# EAGLE schematic Front ECU rev7 (EAGLE 8.3.1)
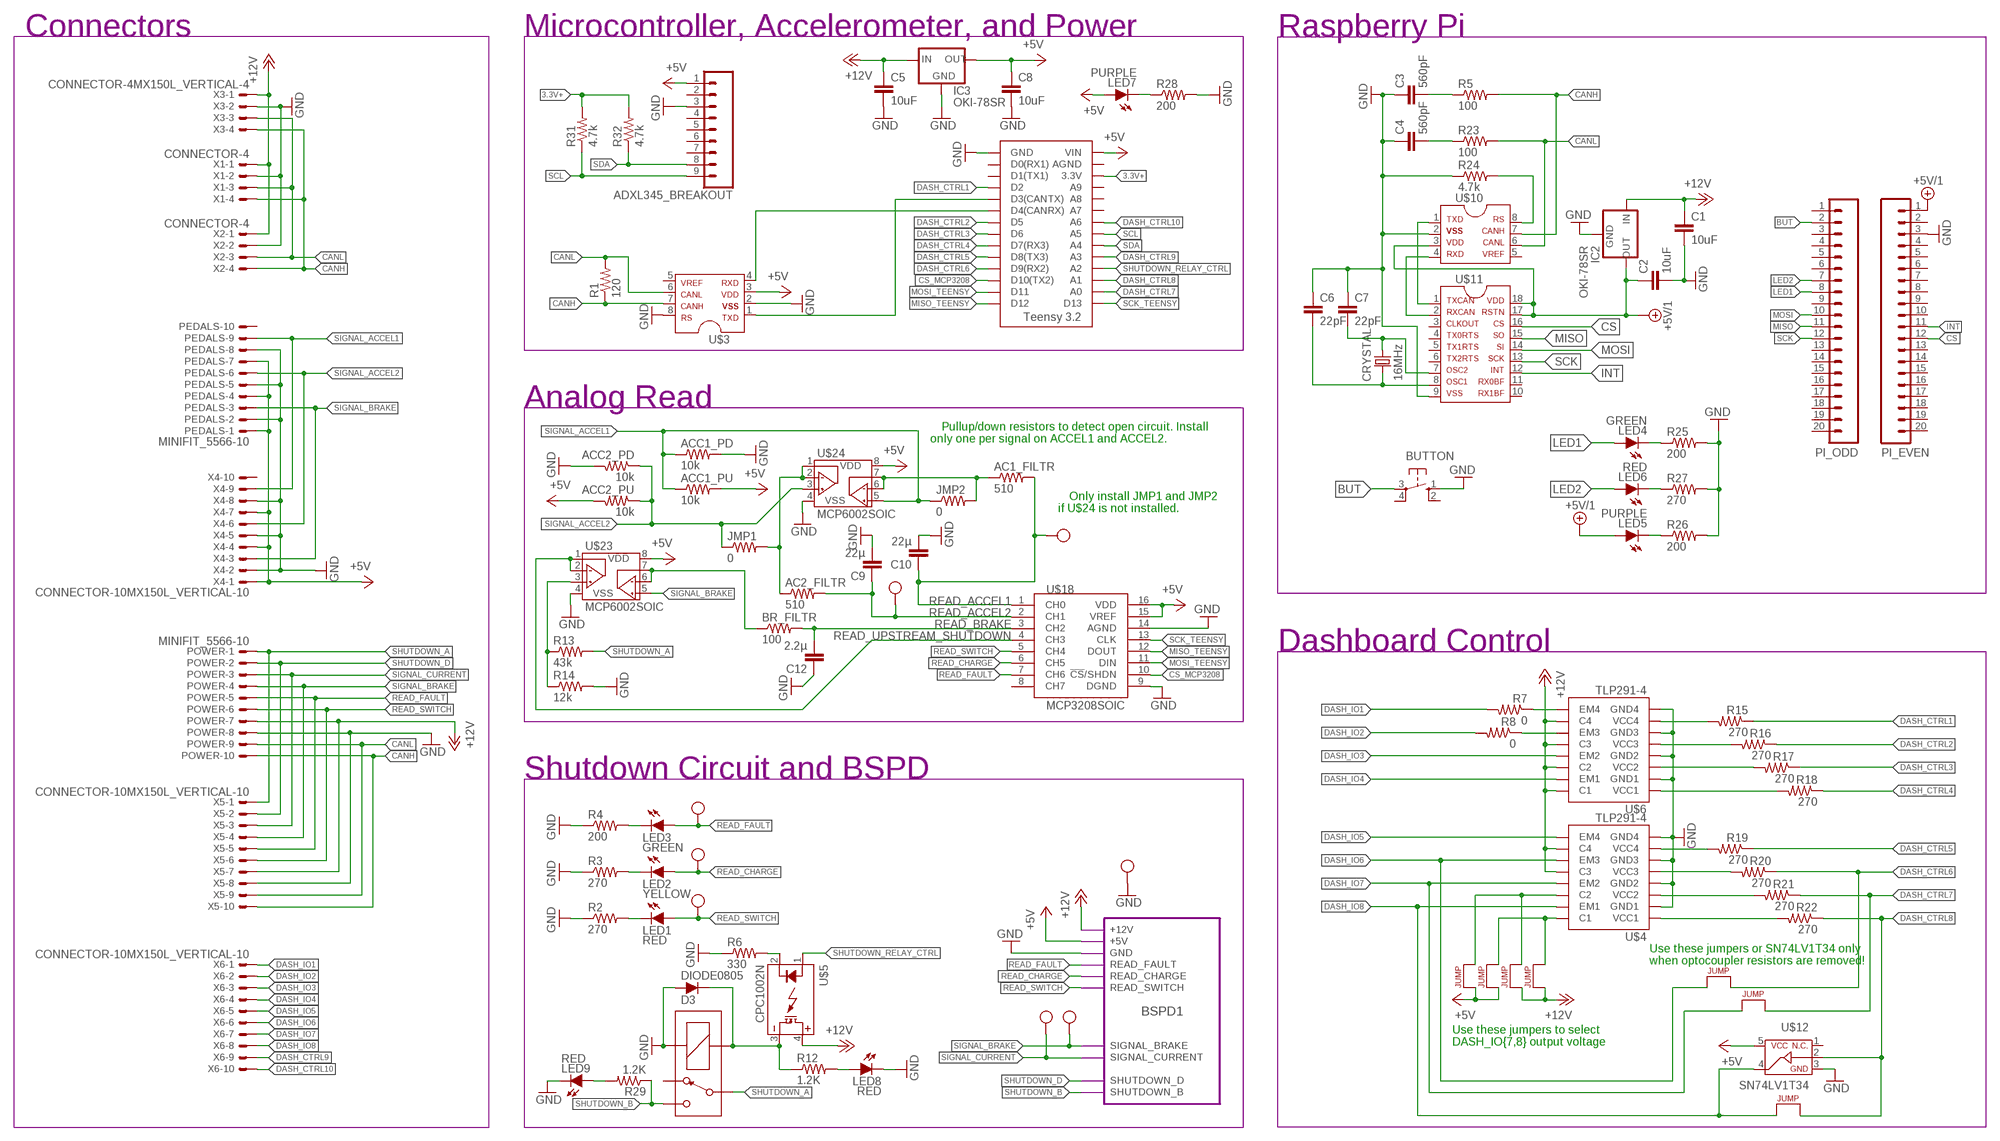
[diagram p0: schematic, sheet 1]

## Parts
AC1_FILTR  510  RESISTOR0805-RES  [0805]
AC2_FILTR  510  RESISTOR0805-RES  [0805]
ACC1_PD  10k  RESISTOR0805-RES  [0805]
ACC1_PU  10k  RESISTOR0805-RES  [0805]
ACC2_PD  10k  RESISTOR0805-RES  [0805]
ACC2_PU  10k  RESISTOR0805-RES  [0805]
ADXL345_BREAKOUT  M09  [1X09]
BR_FILTR  100  RESISTOR0805-RES  [0805]
BUTTON  BTN_10-XX  [B3F-10XX]
C1  10uF  CAP0805  [0805]
C2  10uF  CAP0805  [0805]
C3  560pF  CAP0805  [0805]
C4  560pF  CAP0805  [0805]
C5  10uF  CAP0805  [0805]
C6  22pF  CAP0805  [0805]
C7  22pF  CAP0805  [0805]
C8  10uF  CAP0805  [0805]
C9  22µ  CAP0805  [0805]
C10  22µ  CAP0805  [0805]
C12  2.2µ  CAP0805  [0805]
CRYSTAL  16MHz  CRYSTALSMD  [HC49UP]
D3  DIODE0805  [0805_D]
IC2  OKI-78SR  [OKI-78SR]
IC3  OKI-78SR  [OKI-78SR]
JMP1  0  RESISTOR0805-RES  [0805]
JMP2  0  RESISTOR0805-RES  [0805]
LED1  RED  LED-0805  [LED-805]
LED2  YELLOW  LED-0805  [LED-805]
LED3  GREEN  LED-0805  [LED-805]
LED4  GREEN  LED-0805  [LED-805]
LED5  PURPLE  LED-0805  [LED-805]
LED6  RED  LED-0805  [LED-805]
LED7  PURPLE  LED-0805  [LED-805]
LED8  RED  LED-0805  [LED-805]
LED9  RED  LED-0805  [LED-805]
PEDALS  MINIFIT_5566-10  [MINIFIT_5566-10]
PI_EVEN  M20  [1X20]
PI_ODD  M20  [1X20]
POWER  MINIFIT_5566-10  [MINIFIT_5566-10]
R1  120  RESISTOR0805-RES  [0805]
R2  270  RESISTOR0805-RES  [0805]
R3  270  RESISTOR0805-RES  [0805]
R4  200  RESISTOR0805-RES  [0805]
R5  100  RESISTOR0805-RES  [0805]
R6  330  RESISTOR0805-RES  [0805]
R7  0  RESISTOR0805-RES  [0805]
R8  0  RESISTOR0805-RES  [0805]
R12  1.2K  RESISTOR0805-RES  [0805]
R13  43k  RESISTOR0805-RES  [0805]
R14  12k  RESISTOR0805-RES  [0805]
R15  270  RESISTOR0805-RES  [0805]
R16  270  RESISTOR0805-RES  [0805]
R17  270  RESISTOR0805-RES  [0805]
R18  270  RESISTOR0805-RES  [0805]
R19  270  RESISTOR0805-RES  [0805]
R20  270  RESISTOR0805-RES  [0805]
R21  270  RESISTOR0805-RES  [0805]
R22  270  RESISTOR0805-RES  [0805]
R23  100  RESISTOR0805-RES  [0805]
R24  4.7k  RESISTOR0805-RES  [0805]
R25  200  RESISTOR0805-RES  [0805]
R26  200  RESISTOR0805-RES  [0805]
R27  270  RESISTOR0805-RES  [0805]
R28  200  RESISTOR0805-RES  [0805]
R29  1.2K  RESISTOR0805-RES  [0805]
R31  4.7k  RESISTOR0805-RES  [0805]
R32  4.7k  RESISTOR0805-RES  [0805]
SOFTWARE_SHUTOFF  G5LE  [ZF112]
U$1  TEENSY_3.2_SIMPLE  [TEENSY_3.2_SIMPLE]
U$2  TEST_POINT  [TEST_POINT]
U$3  MCP2551  [SOIC-08]
U$4  TLP291-4  [SOIC-16]
U$5  CPC1002N  [SOP04]
U$6  TLP291-4  [SOIC-16]
U$7  JUMPER  [0805]
U$8  JUMPER  [0805]
U$9  JUMPER  [0805]
U$10  MCP2551  [SOIC-08]
U$11  MCP2515SMD  [SOIC-18W]
U$12  SN74LV1T34  [SOT-23-5]
U$13  TEST_POINT  [TEST_POINT]
U$14  TEST_POINT  [TEST_POINT]
U$15  TEST_POINT  [TEST_POINT]
U$16  TEST_POINT  [TEST_POINT]
U$17  TEST_POINT  [TEST_POINT]
U$18  MCP3208SOIC  [SOIC-16]
U$19  JUMPER  [0805]
U$20  JUMPER  [0805]
U$21  JUMPER  [0805]
U$22  JUMPER  [0805]
U$23  MCP6002SOIC  [SOIC-08]
U$24  MCP6002SOIC  [SOIC-08]
U$25  TEST_POINT  [TEST_POINT]
U$26  TEST_POINT  [TEST_POINT]
X1  CONNECTOR-4  [MINIFIT_5566-4]
X2  CONNECTOR-4  [MINIFIT_5566-4]
X3  CONNECTOR-4MX150L_VERTICAL-4  [MX150L_VERTICAL-4]
X4  CONNECTOR-10MX150L_VERTICAL-10  [MX150L_VERTICAL-10]
X5  CONNECTOR-10MX150L_VERTICAL-10  [MX150L_VERTICAL-10]
X6  CONNECTOR-10MX150L_VERTICAL-10  [MX150L_VERTICAL-10]

## Module instances
BSPD1 = BSPD

## Nets
3.3V+: R31.2 R32.2 U$1.3.3V
+5V: ACC1_PU.2 ACC2_PU.2 ADXL345_BREAKOUT.1 C8.1 IC3.3(OUT) LED7.A PEDALS.1 PEDALS.4 PEDALS.7 U$1.VIN U$3.3 U$12.5 U$18.15(VREF) U$18.16(VDD) U$20.1 U$22.1 U$23.8(VDD) U$24.8(VDD) X4.1 X4.4 X4.7 ; port BSPD1.+5V
+5V/1: C2.1 IC2.3(OUT) LED5.A PI_EVEN.1 U$10.3 U$11.17 U$11.18
+12V: C1.1 C5.1 IC2.1(IN) IC3.1(IN) POWER.7 U$4.10(C4) U$4.12(C3) U$5.4(DC+) U$6.10(C4) U$6.12(C3) U$6.14(C2) U$6.16(C1) U$9.1 U$21.1 X1.1 X2.1 X3.1 X5.7 ; port BSPD1.+12V
BUT: BUTTON.3(P) PI_ODD.2
CANH: POWER.10 R1.1 R5.2 U$3.7 U$10.7 X1.4 X2.4 X3.4 X5.10
CANL: POWER.9 R1.2 R23.2 U$3.6 U$10.6 X1.3 X2.3 X3.3 X5.9
CS: PI_EVEN.12 U$11.16
CS_MCP3208: U$1.D10(TX2) U$18.10(!CS!/SHDN)
DASH_CTRL1: R15.1 U$1.D2
DASH_CTRL2: R16.1 U$1.D5
DASH_CTRL3: R17.1 U$1.D6
DASH_CTRL4: R18.1 U$1.D7(RX3)
DASH_CTRL5: R19.1 U$1.D8(TX3)
DASH_CTRL6: R20.1 U$1.D9(RX2) U$7.2
DASH_CTRL7: R21.1 U$1.A0 U$8.2
DASH_CTRL8: R22.1 U$1.A1 U$12.2 U$19.2
DASH_CTRL9: U$1.A3 X6.9
DASH_CTRL10: U$1.A6 X6.10
DASH_IO1: R7.2 X6.1
DASH_IO2: R8.2 X6.2
DASH_IO3: U$6.13(EM2) X6.3
DASH_IO4: U$6.15(EM1) X6.4
DASH_IO5: U$4.9(EM4) X6.5
DASH_IO6: U$4.11(EM3) U$7.1 X6.6
DASH_IO7: U$4.13(EM2) U$8.1 X6.7
DASH_IO8: U$4.15(EM1) U$12.4 U$19.1 X6.8
GND: ACC1_PD.2 ACC2_PD.2 ADXL345_BREAKOUT.3 BUTTON.1(S) C1.2 C2.2 C3.1 C4.1 C5.2 C6.1 C7.1 C8.2 C9.2 C10.2 C12.1 D3.A IC2.2(GND) IC3.2(GND) LED8.C LED9.C PEDALS.2 PEDALS.5 PEDALS.8 PI_EVEN.3 POWER.8 R2.1 R3.1 R4.1 R6.1 R14.2 R24.1 R25.2 R26.2 R27.2 R28.2 SOFTWARE_SHUTOFF.1(COIL+) U$1.GND U$2.P$1 U$3.2 U$3.8 U$4.2(GND1) U$4.4(GND2) U$4.6(GND3) U$4.8(GND4) U$6.2(GND1) U$6.4(GND2) U$6.6(GND3) U$6.8(GND4) U$10.2 U$11.9 U$12.3 U$18.9(DGND) U$18.14(AGND) U$23.4(VSS) U$24.4(VSS) X1.2 X2.2 X3.2 X4.2 X4.5 X4.8 X5.8 ; port BSPD1.GND
INT: PI_EVEN.11 U$11.12
LED1: LED4.A PI_ODD.8
LED2: LED6.A PI_ODD.7
MISO: PI_ODD.11 U$11.15
MISO_TEENSY: U$1.D12 U$18.12(DOUT)
MOSI: PI_ODD.10 U$11.14
MOSI_TEENSY: U$1.D11 U$18.11(DIN)
N$1: R7.1 U$6.9(EM4)
N$2: U$1.D4(CANRX) U$3.4
N$3: R8.1 U$6.11(EM3)
N$4: U$4.16(C1) U$9.2 U$20.2
N$5: U$1.D3(CANTX) U$3.1
N$6: U$4.14(C2) U$21.2 U$22.2
N$7: R13.1 R14.1 U$23.3(VINA+)
N$8: LED8.A R12.2
N$9: LED9.A R29.2
N$11: BR_FILTR.1 U$23.6(VINB-) U$23.7(VOUTB)
N$12: D3.C R12.1 SOFTWARE_SHUTOFF.2(COIL-) U$5.3(DC-)
N$13: AC2_FILTR.1 JMP1.2 U$24.1(VOUTA) U$24.2(VINA-)
N$14: LED1.C R2.2
N$15: LED2.C R3.2
N$16: LED3.C R4.2
N$17: AC1_FILTR.1 JMP2.2 U$24.6(VINB-) U$24.7(VOUTB)
N$19: R15.2 U$6.7(VCC4)
N$22: R6.2 U$5.2(CONTROL-)
N$24: R16.2 U$6.5(VCC3)
N$27: R21.2 U$4.3(VCC2)
N$28: R17.2 U$6.3(VCC2)
N$29: R18.2 U$6.1(VCC1)
N$31: R19.2 U$4.7(VCC4)
N$32: R20.2 U$4.5(VCC3)
N$35: R22.2 U$4.1(VCC1)
N$37: U$10.1 U$11.1
N$39: U$10.4 U$11.2
N$40: C6.2 CRYSTAL.2 U$11.8
N$41: R24.2 U$10.8
N$42: C7.2 CRYSTAL.1 U$11.7
N$43: C3.2 R5.1
N$50: C4.2 R23.1
N$52: LED4.C R25.1
N$53: LED5.C R26.1
N$54: LED6.C R27.1
N$61: LED7.C R28.1
READ_ACCEL1: AC1_FILTR.2 C10.1 U$18.1(CH0) U$26.P$1
READ_ACCEL2: AC2_FILTR.2 C9.1 U$18.2(CH1) U$25.P$1
READ_BRAKE: BR_FILTR.2 C12.2 U$18.3(CH2)
READ_CHARGE: LED2.A U$16.P$1 U$18.6(CH5) ; port BSPD1.READ_CHARGE
READ_FAULT: LED3.A POWER.5 U$15.P$1 U$18.7(CH6) X5.5 ; port BSPD1.READ_FAULT
READ_SWITCH: LED1.A POWER.6 U$17.P$1 U$18.5(CH4) X5.6 ; port BSPD1.READ_SWITCH
READ_UPSTREAM_SHUTDOWN: U$18.4(CH3) U$23.1(VOUTA) U$23.2(VINA-)
SCK: PI_ODD.12 U$11.13
SCK_TEENSY: U$1.D13 U$18.13(CLK)
SCL: ADXL345_BREAKOUT.9 R31.1 U$1.A5
SDA: ADXL345_BREAKOUT.8 R32.1 U$1.A4
SHUTDOWN_A: POWER.1 R13.2 SOFTWARE_SHUTOFF.P X5.1
SHUTDOWN_B: R29.1 SOFTWARE_SHUTOFF.S ; port BSPD1.SHUTDOWN_B
SHUTDOWN_D: POWER.2 X5.2 ; port BSPD1.SHUTDOWN_D
SHUTDOWN_RELAY_CTRL: U$1.A2 U$5.1(CONTROL+)
SIGNAL_ACCEL1: ACC1_PD.1 ACC1_PU.1 JMP2.1 PEDALS.9 U$24.5(VINB+) X4.9
SIGNAL_ACCEL2: ACC2_PD.1 ACC2_PU.1 JMP1.1 PEDALS.6 U$24.3(VINA+) X4.6
SIGNAL_BRAKE: PEDALS.3 POWER.4 U$13.P$1 U$23.5(VINB+) X4.3 X5.4 ; port BSPD1.SIGNAL_BRAKE
SIGNAL_CURRENT: POWER.3 U$14.P$1 X5.3 ; port BSPD1.SIGNAL_CURRENT
Unconnected: ADXL345_BREAKOUT.2 ADXL345_BREAKOUT.4 ADXL345_BREAKOUT.5 ADXL345_BREAKOUT.6 ADXL345_BREAKOUT.7 BUTTON.2(S1) BUTTON.4(P1) PEDALS.10 PI_EVEN.2 PI_EVEN.4 PI_EVEN.5 PI_EVEN.6 PI_EVEN.7 PI_EVEN.8 PI_EVEN.9 PI_EVEN.10 PI_EVEN.13 PI_EVEN.14 PI_EVEN.15 PI_EVEN.16 PI_EVEN.17 PI_EVEN.18 PI_EVEN.19 PI_EVEN.20 PI_ODD.1 PI_ODD.3 PI_ODD.4 PI_ODD.5 PI_ODD.6 PI_ODD.9 PI_ODD.13 PI_ODD.14 PI_ODD.15 PI_ODD.16 PI_ODD.17 PI_ODD.18 PI_ODD.19 PI_ODD.20 SOFTWARE_SHUTOFF.O U$1.A7 U$1.A8 U$1.A9 U$1.AGND U$1.D0(RX1) U$1.D1(TX1) U$3.5 U$10.5 U$11.3 U$11.4 U$11.5 U$11.6 U$11.10 U$11.11 U$12.1 U$18.8(CH7) X4.10

## Notes on the sheet
- Connectors | Microcontroller, Accelerometer, and Power | Raspberry Pi
- Analog Read
- ⇦ Pullup/down resistors to detect open circuit. Install
  only one per signal on ACCEL1 and ACCEL2.
- ⇦ Only install JMP1 and JMP2
  if U$24 is not installed.
- Dashboard Control
- Shutdown Circuit and BSPD
- Use these jumpers or SN74LV1T34 only
  when optocoupler resistors are removed!
- Use these jumpers to select
  DASH_IO{7,8} output voltage

## Library data of the parts
AC1_FILTR AC2_FILTR ACC1_PD ACC1_PU ACC2_PD ACC2_PU BR_FILTR JMP1 JMP2 R1-R8 R12-R29 R31 R32 = HyTechDevices:RESISTOR: Resistor Basic schematic elements and footprints for 0603, 1206, and PTH resistors.
ADXL345_BREAKOUT = HyTechDevices:M09: Standard 9-pin 0.1" header. Source: Sparkfun <https://github.com/sparkfun/SparkFun-Eagle-Libraries>
BUTTON = HyTechDevices:BTN_10-XX: Small momentary tactile push button; MPN: B3F-1000; OC_FARNELL: 176432; OC_NEWARK: 36M3542
C1-C10 C12 = HyTechDevices:CAP: Capacitor Standard 0603 ceramic capacitor, and 0.1" leaded capacitor.
CRYSTAL = SparkFun-FreqCtrl:CRYSTAL: Various standard crystals. Proven footprints.
D3 = HyTechDevices:DIODE: DIODE general purpose rectifier
IC2 IC3 = HyTechDevices:OKI-78SR: Murata OKI-78SR Non-Isolated Switching Regulator DC/DC - Datasheet <https://power.murata.com/data/power/oki-78sr.pdf>
LED1-LED9 = HyTechDevices:LED: Light Emitting Diode (LED) Source: Dangerous Prototypes Eagle Library <https://github.com/DangerousPrototypes/Eagle_Part_Library>
PEDALS POWER = HyTechDevices:MINIFIT_5566-10: Mini-Fit Junior connector 10 pole Source: http://www.molex.com; OC_FARNELL: unknown; OC_NEWARK: unknown
PI_EVEN PI_ODD = HyTechDevices:M20: 1x20 .1" header This is just like the LOCK variant in that the holes are staggared by 5 mil, but except for the last two holes. They are not altered from the "standard" footprint layout. This is used for a special purpose on the layout of our Graphic LCD Backpack. Make sure you want to use this device before selecting it for you project! Source: Sparkfun <https://github.com/sparkfun/SparkFun-Eagle-Libraries>
SOFTWARE_SHUTOFF = HyTechDevices:G5LE: Omron G5LE SPST Relay 5 VDC, 12VDC, 24VDC models Coil voltage: 75% - 170% of nominal voltage Datasheet <https://www.omron.com/ecb/products/pdf/en-g5le.pdf>
U$1 = HyTechDevices:TEENSY_3.2_SIMPLE: Simple version of the Teensy 3.2 board that only uses the 2 main rows of pins, not the inner pins or the pins opposite the usb port.
U$2 U$13-U$17 U$25 U$26 = HyTechDevices:TEST_POINT: Keystone Electronics Test Point 5005
U$3 U$10 = HyTechDevices:MCP2551: MCP2551 High-Speed CAN Transceiver Product Webpage <https://www.microchip.com/wwwproducts/en/MCP2551> Datasheet <http://ww1.microchip.com/downloads/en/DeviceDoc/21667f.pdf> This device is outdated It is replaced by MCP2561. Comparison Page <https://www.microchip.com/wwwproducts/ProductCompare/MCP2551/MCP2561> Product Webpage <https://www.microchip.com/wwwproducts/en/MCP2561> Datasheet <http://ww1.microchip.com/downloads/en/DeviceDoc/20005167C.pdf>
U$4 U$6 = HyTechDevices:TLP291-4: Toshiba Quad Channel Optocoupler TLP291-4
U$5 = HyTechDevices:CPC1002N: IXYS Solid State Relay .7A
U$7-U$9 U$19-U$22 = HyTechDevices:JUMPER: Jumper for changing operation of a device
U$11 = HyTechDevices:MCP2515: MCP2515 CAN Controller with SPI Interface Datasheet <http://ww1.microchip.com/downloads/en/DeviceDoc/21801G.pdf>
U$12 = HyTechDevices:SN74LV1T34: TI SN74LV1T34 Single Power Supply Single Buffer GATE CMOS Logic Level Shifter Datasheet <http://www.ti.com/lit/ds/symlink/sn74lv1t34.pdf>
U$18 = HyTechDevices:MCP3208: Analog to Digital Converter
U$23 U$24 = HyTechDevices:MCP6002: Microchip MCP6002 Dual Channel Op Amp
X1 X2 = HyTechDevices:CONNECTOR-4: Mini-Fit Junior connector 4 pole Source: http://www.molex.com; OC_FARNELL: unknown; OC_NEWARK: unknown
X3 = HyTechDevices:CONNECTOR-4: Mini-Fit Junior connector 4 pole Source: http://www.molex.com
X4-X6 = HyTechDevices:CONNECTOR-10: Mini-Fit Junior connector 10 pole Source: http://www.molex.com

## Module BSPD
Ports: GND(out) +5V(in) READ_CHARGE(out) SHUTDOWN_B(in) READ_SWITCH(out) READ_FAULT(out) SHUTDOWN_D(out) SIGNAL_BRAKE(in) SIGNAL_CURRENT(in) +12V(in)
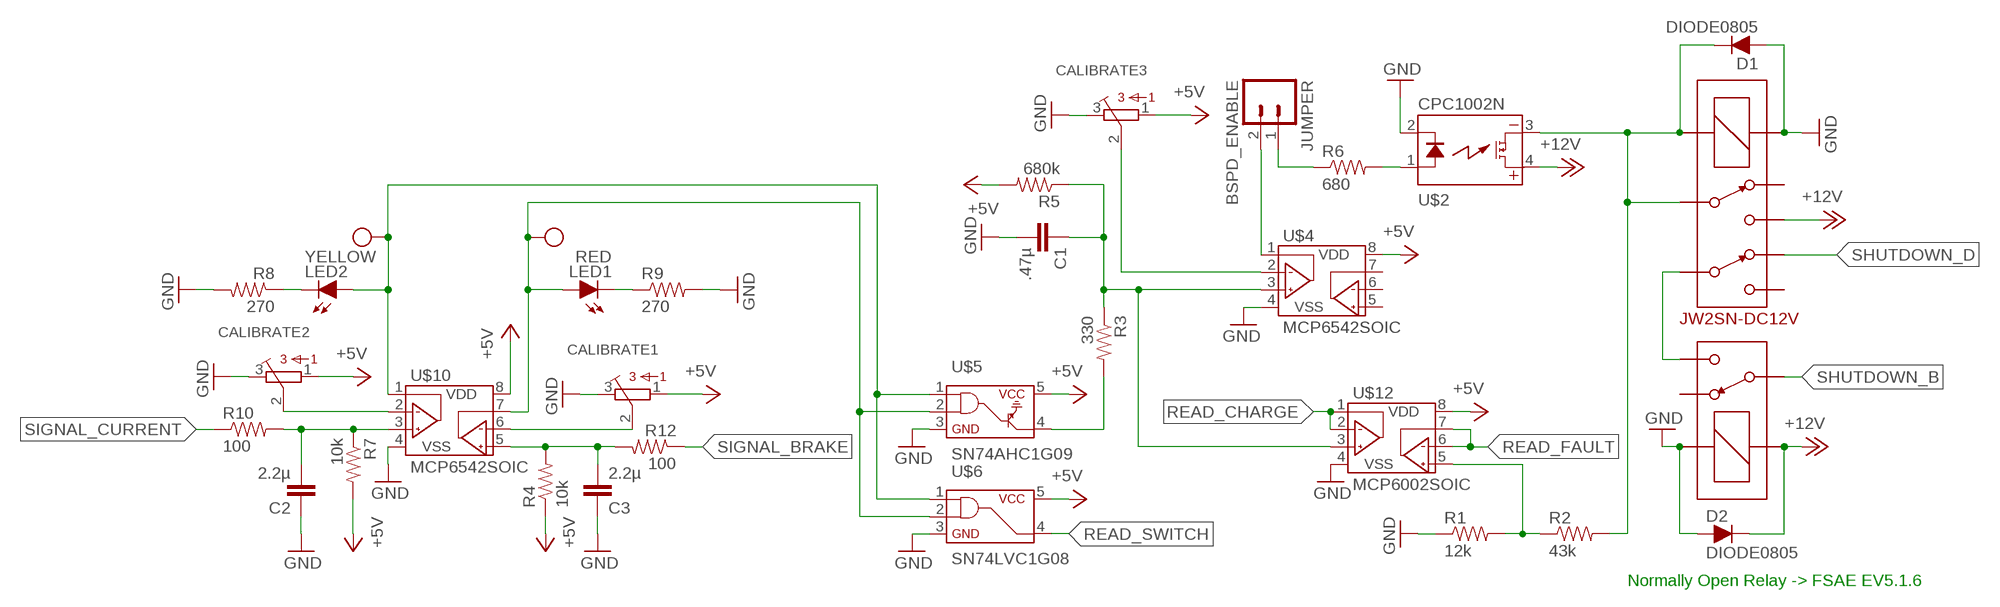
[diagram p1: schematic, module BSPD, sheet 1]

### Parts
BSPD_ENABLE  JUMPER  M02  [1X02]
C1  .47µ  CAP0805  [0805]
C2  2.2µ  CAP0805  [0805]
C3  2.2µ  CAP0805  [0805]
CALIBRATE1  TRIMPOT_3296C  [TRIMPOT_3296]
CALIBRATE2  TRIMPOT_3296C  [TRIMPOT_3296]
CALIBRATE3  TRIMPOT_3296C  [TRIMPOT_3296]
D1  DIODE0805  [0805_D]
D2  DIODE0805  [0805_D]
LED1  RED  LED-0805  [LED-805]
LED2  YELLOW  LED-0805  [LED-805]
R1  12k  RESISTOR0805-RES  [0805]
R2  43k  RESISTOR0805-RES  [0805]
R3  330  RESISTOR0805-RES  [0805]
R4  10k  RESISTOR0805-RES  [0805]
R5  680k  RESISTOR0805-RES  [0805]
R6  680  RESISTOR0805-RES  [0805]
R7  10k  RESISTOR0805-RES  [0805]
R8  270  RESISTOR0805-RES  [0805]
R9  270  RESISTOR0805-RES  [0805]
R10  100  RESISTOR0805-RES  [0805]
R12  100  RESISTOR0805-RES  [0805]
U$1  G5LE  [ZF112]
U$2  CPC1002N  [SOP04]
U$3  JW2SN-DC12V  [JW2SN]
U$4  MCP6542SOIC  [SOIC-08]
U$5  SN74AHC1G09  [SOT-23-5]
U$6  SN74LVC1G08  [SOT-23-5]
U$10  MCP6542SOIC  [SOIC-08]
U$11  TEST_POINT  [TEST_POINT]
U$12  MCP6002SOIC  [SOIC-08]
U$13  TEST_POINT  [TEST_POINT]

### Nets
+5V: CALIBRATE1.1 CALIBRATE2.1 CALIBRATE3.1 R4.1 R5.2 R7.2 U$4.8(VDD) U$5.5 U$6.5 U$10.8(VDD) U$12.8(VDD)
+12V: D2.C U$1.2(COIL-) U$2.4(DC+) U$3.4
GND: C1.2 C2.1 C3.1 CALIBRATE1.3 CALIBRATE2.3 CALIBRATE3.3 D1.A D2.A R1.1 R8.2 R9.2 U$1.1(COIL+) U$2.2(CONTROL-) U$3.COIL+ U$4.4(VSS) U$5.3 U$6.3 U$10.4(VSS) U$12.4(VSS)
N$1: D1.C R2.2 U$2.3(DC-) U$3.3 U$3.COIL-
N$2: R3.2 U$5.4
N$3: R6.2 U$2.1(CONTROL+)
N$4: BSPD_ENABLE.1 R6.1
N$5: CALIBRATE2.2 U$10.2(VINA-)
N$6: CALIBRATE1.2 U$10.6(VINB-)
N$7: CALIBRATE3.2 U$4.2(VINA-)
N$8: BSPD_ENABLE.2 U$4.1(VOUTA)
N$9: R1.2 R2.1 U$12.5(VINB+)
N$13: C1.1 R3.1 R5.1 U$4.3(VINA+) U$12.3(VINA+)
N$14: LED2.C R8.1
N$15: LED1.C R9.1
N$16: LED1.A U$5.2 U$6.2 U$10.7(VOUTB) U$11.P$1
N$17: LED2.A U$5.1 U$6.1 U$10.1(VOUTA) U$13.P$1
READ_CHARGE: U$12.1(VOUTA) U$12.2(VINA-)
READ_FAULT: U$12.6(VINB-) U$12.7(VOUTB)
READ_SWITCH: U$6.4
SHUTDOWN_B: U$1.P
SHUTDOWN_C: U$1.S U$3.6
SHUTDOWN_D: U$3.7
SIGNAL_BRAKE: R12.1
SIGNAL_BRAKE_FILT: C3.2 R4.2 R12.2 U$10.5(VINB+)
SIGNAL_CURRENT: R10.1
SIGNAL_CURRENT_FILT: C2.2 R7.1 R10.2 U$10.3(VINA+)
Unconnected: U$1.O U$3.2 U$3.5 U$4.5(VINB+) U$4.6(VINB-) U$4.7(VOUTB)

### Notes on the sheet
- Normally Open Relay -> FSAE EV5.1.6

### Library data of the parts
BSPD_ENABLE = HyTechDevices:M02: Standard 2-pin 0.1" header. NOTES ON THE VARIANTS LOCK and LOCK_LONGPADS... This footprint was designed to help hold the alignment of a through-hole component (i.e. 6-pin header) while soldering it into place. You may notice that each hole has been shifted either up or down by 0.005 of an inch from it's more standard position (which is a perfectly straight line). This slight alteration caused the pins (the squares in the middle) to touch the edges of the holes. Because they are alternating, it causes a "brace" to hold the component in place. 0.005 has proven to be the perfect amount of "off-center" position when using our standard breakaway headers. Although looks a little odd when you look at the bare footprint, once you have a header in there, the alteration is very hard to notice. Also,if you push a header all the way into place, it is covered up entirely on the bottom side. This idea of altering the position of holes to aid alignment will be further integrated into the Sparkfun Library for other footprints. It can help hold any component with 3 or more connection pins. Note: The Sparkfun version includes many other packages including surface mount that may be of future interest. Source: Sparkfun <https://github.com/sparkfun/SparkFun-Eagle-Libraries>
C1-C3 = HyTechDevices:CAP: Capacitor Standard 0603 ceramic capacitor, and 0.1" leaded capacitor.
CALIBRATE1-CALIBRATE3 = HyTechDevices:TRIMPOT_3296: 3296 Series 3/8" Square Trimmer Source <https://github.com/chiengineer/Eagle-Libraries/blob/master/Potentiometers/bourns.lbr>
D1 D2 = HyTechDevices:DIODE: DIODE general purpose rectifier
LED1 LED2 = HyTechDevices:LED: Light Emitting Diode (LED) Source: Dangerous Prototypes Eagle Library <https://github.com/DangerousPrototypes/Eagle_Part_Library>
R1-R10 R12 = HyTechDevices:RESISTOR: Resistor Basic schematic elements and footprints for 0603, 1206, and PTH resistors.
U$1 = HyTechDevices:G5LE: Omron G5LE SPST Relay 5 VDC, 12VDC, 24VDC models Coil voltage: 75% - 170% of nominal voltage Datasheet <https://www.omron.com/ecb/products/pdf/en-g5le.pdf>
U$2 = HyTechDevices:CPC1002N: IXYS Solid State Relay .7A
U$3 = HyTechDevices:JW2SN-DC12V: Panasonic Double Pull Double Throw Relay 12VDC Datasheet <http://www.mouser.com/ds/2/316/jw-catalog-461998.pdf> Product Page <http://www.mouser.com/ProductDetail/Panasonic-Industrial-Devices/JW2SN-DC12V>
U$4 U$10 = HyTechDevices:MCP6542: Microchip MCP6542 Dual Channel Push-Pull Comparator
U$5 = HyTechDevices:SN74AHC1G09: TI SN74AHC1G09 Single 2–Input Positive-AND Gate With Open-Drain Output Datasheet <http://www.ti.com/lit/ds/symlink/sn74ahc1g09.pdf>
U$6 = HyTechDevices:SN74LVC1G08: TI SN74LVC1G08 SINGLE 2-INPUT POSITIVE-AND GATE Datasheet <http://www.ti.com/lit/ds/sces556f/sces556f.pdf>
U$11 U$13 = HyTechDevices:TEST_POINT: Keystone Electronics Test Point 5005
U$12 = HyTechDevices:MCP6002: Microchip MCP6002 Dual Channel Op Amp